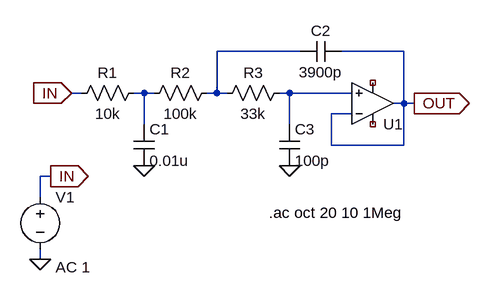
[diagram p0: schematic 3rd-VCVS-LPF-2.0kHz.asc]
3rd-VCVS-LPF-2.0kHz.asc, the LTspice schematic file:
Version 4
SHEET 1 880 680
WIRE 384 160 256 160
WIRE 544 160 448 160
WIRE 48 224 32 224
WIRE 144 224 128 224
WIRE 160 224 144 224
WIRE 256 224 256 160
WIRE 256 224 240 224
WIRE 272 224 256 224
WIRE 368 224 352 224
WIRE 464 224 368 224
WIRE 544 240 544 160
WIRE 544 240 528 240
WIRE 560 240 544 240
WIRE 464 256 432 256
WIRE 144 272 144 224
WIRE 368 272 368 224
WIRE 432 304 432 256
WIRE 544 304 544 240
WIRE 544 304 432 304
WIRE 0 352 -16 352
WIRE -16 384 -16 352
WIRE -16 480 -16 464
FLAG 144 336 0
FLAG 368 336 0
FLAG 32 224 IN
IOPIN 32 224 In
FLAG 560 240 OUT
IOPIN 560 240 Out
FLAG -16 480 0
FLAG 0 352 IN
IOPIN 0 352 Out
SYMBOL cap 128 272 R0
SYMATTR InstName C1
SYMATTR Value 0.01u
SYMBOL res 144 208 R90
WINDOW 0 0 56 VBottom 2
WINDOW 3 32 56 VTop 2
SYMATTR InstName R1
SYMATTR Value 10k
SYMBOL res 256 208 R90
WINDOW 0 0 56 VBottom 2
WINDOW 3 32 56 VTop 2
SYMATTR InstName R2
SYMATTR Value 100k
SYMBOL res 368 208 R90
WINDOW 0 0 56 VBottom 2
WINDOW 3 32 56 VTop 2
SYMATTR InstName R3
SYMATTR Value 33k
SYMBOL cap 448 144 R90
WINDOW 0 0 32 VBottom 2
WINDOW 3 32 32 VTop 2
SYMATTR InstName C2
SYMATTR Value 3900p
SYMBOL cap 352 272 R0
SYMATTR InstName C3
SYMATTR Value 100p
SYMBOL voltage -16 368 R0
WINDOW 123 24 124 Left 2
WINDOW 39 0 0 Left 2
SYMATTR InstName V1
SYMATTR Value ""
SYMATTR Value2 AC 1
SYMBOL Opamps\\UniversalOpamp2 496 240 M180
SYMATTR InstName U1
TEXT 336 408 Left 2 !.ac oct 20 10 1Meg

The netlist it stands for:
* 3rd-VCVS-LPF-2.0kHz.asc
C1 N002 0 0.01u
R1 N002 IN 10k
R2 N001 N002 100k
R3 N003 N001 33k
C2 OUT N001 3900p
C3 N003 0 100p
V1 IN 0 AC 1
XU1 N003 OUT NC_01 NC_02 OUT level.2 Avol=1Meg GBW=10Meg Slew=10Meg ilimit=25m rail=0 Vos=0 phimargin=45 en=0 enk=0 in=0 ink=0 Rin=500Meg  ; pins IN+ IN- V+ V- OUT
.ac oct 20 10 1Meg
.lib UniversalOpamps2.sub
.backanno
.end